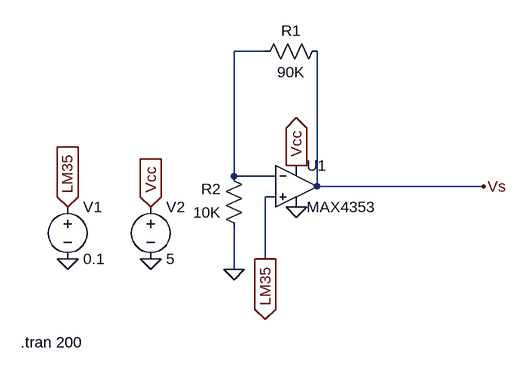
[diagram p0: schematic AOP.asc]
AOP.asc, the LTspice schematic file:
Version 4
SHEET 1 880 680
WIRE 128 -48 80 -48
WIRE 80 144 80 -48
WIRE 144 144 80 144
WIRE 208 160 208 -48
WIRE 464 160 208 160
WIRE 144 176 128 176
WIRE 128 272 128 176
WIRE 80 288 80 224
FLAG -48 272 0
FLAG -176 272 0
FLAG -176 192 LM35
IOPIN -176 192 In
FLAG -48 192 Vcc
IOPIN -48 192 In
FLAG 176 128 Vcc
IOPIN 176 128 Out
FLAG 176 192 0
FLAG 80 288 0
FLAG 128 272 LM35
IOPIN 128 272 Out
FLAG 464 160 Vs
SYMBOL OpAmps\\MAX4353 176 96 R0
SYMATTR InstName U1
SYMBOL voltage -176 176 R0
WINDOW 123 0 0 Left 0
WINDOW 39 0 0 Left 0
SYMATTR InstName V1
SYMATTR Value 0.1
SYMBOL voltage -48 176 R0
WINDOW 123 0 0 Left 0
WINDOW 39 0 0 Left 0
SYMATTR InstName V2
SYMATTR Value 5
SYMBOL res 224 -64 R90
WINDOW 0 0 56 VBottom 2
WINDOW 3 32 56 VTop 2
SYMATTR InstName R1
SYMATTR Value 90K
SYMBOL res 96 240 R180
WINDOW 0 36 76 Left 2
WINDOW 3 36 40 Left 2
SYMATTR InstName R2
SYMATTR Value 10K
TEXT -248 400 Left 2 !.tran 200

The netlist it stands for:
* AOP.asc
XU1 LM35 N001 Vcc 0 Vs MAX4353  ; pins In+ In- V+ V- OUT
V1 LM35 0 0.1
V2 Vcc 0 5
R1 Vs N001 90K
R2 0 N001 10K
.tran 200
.backanno
.end